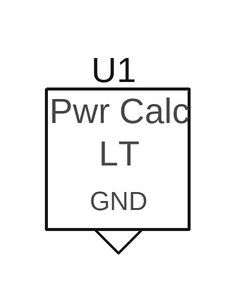
[diagram p0: schematic Draft6.asc]
Draft6.asc, the LTspice schematic file:
Version 4
SHEET 1 880 680
FLAG -128 112 0
SYMBOL MDB_sym\\powcalcSmall -128 64 R0
SYMATTR InstName U1

The netlist it stands for:
* Draft6.asc
XU1 0 powcalc  ; pins GND
.lib powcalc.sub
.backanno
.end